# Altium project Carte_GR_2017_logique_v1.PrjPCB (part 2 of 2)

## Sheet interfaces_fpga.SchDoc
size A3
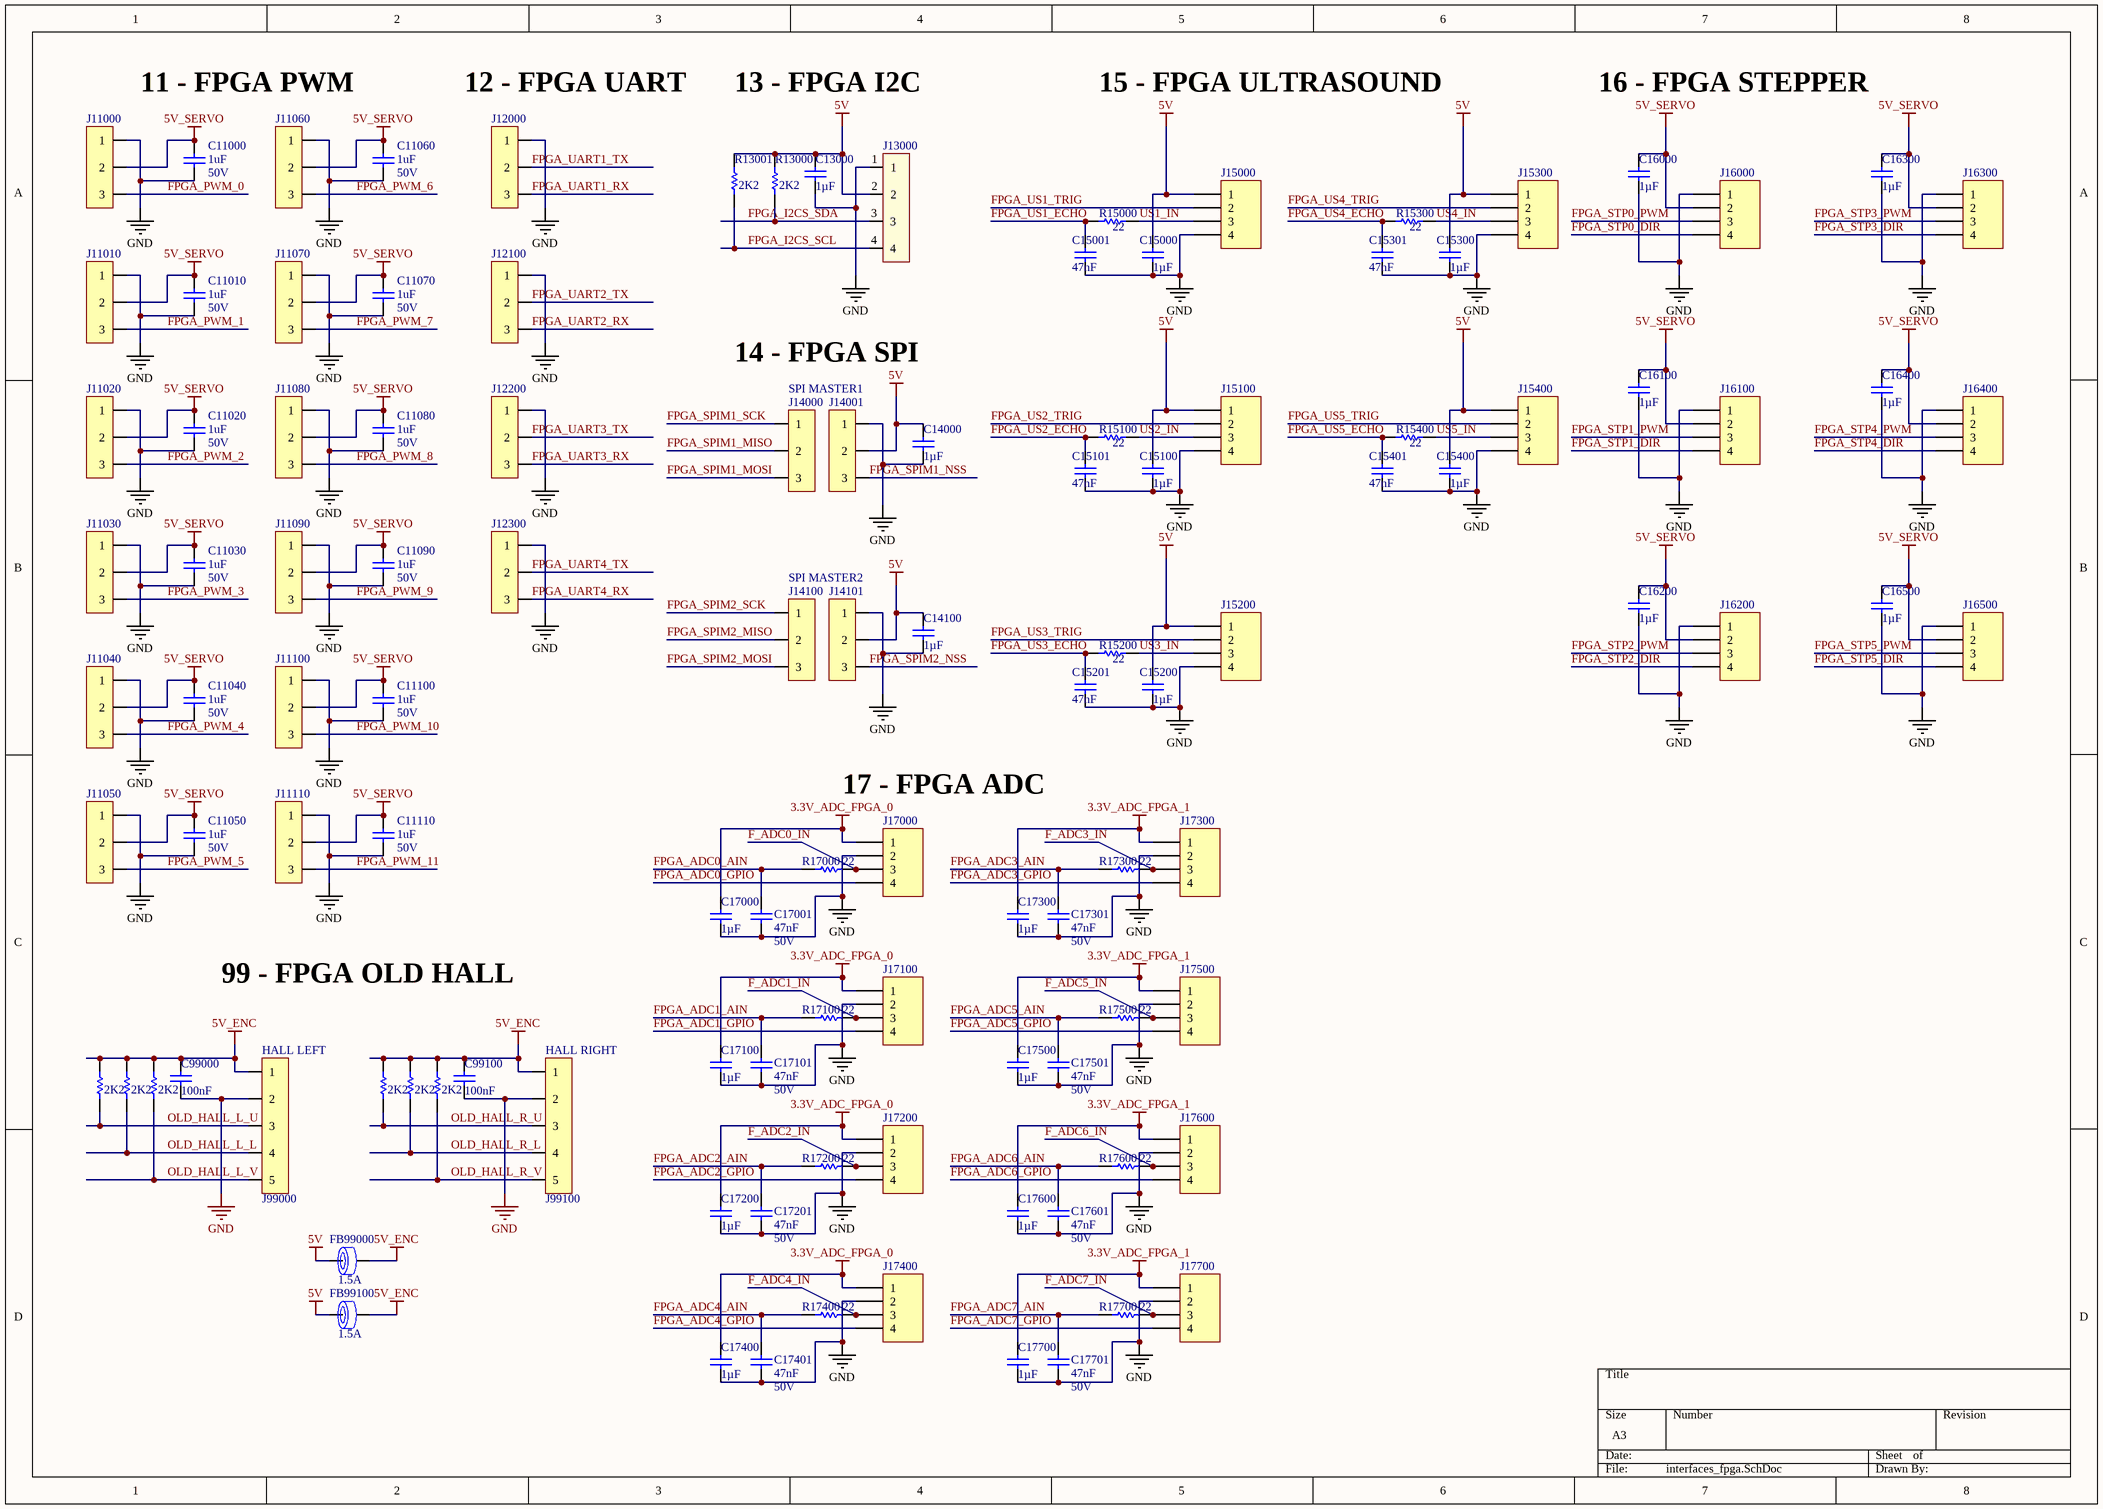
[diagram p2: interfaces_fpga.SchDoc]

### Parts
C11000  1uF  RatedVoltage: 50V  [WCAP-CSGP_0805, 2x1.25x1.25]
C11010  1uF  RatedVoltage: 50V  [WCAP-CSGP_0805, 2x1.25x1.25]
C11020  1uF  RatedVoltage: 50V  [WCAP-CSGP_0805, 2x1.25x1.25]
C11030  1uF  RatedVoltage: 50V  [WCAP-CSGP_0805, 2x1.25x1.25]
C11040  1uF  RatedVoltage: 50V  [WCAP-CSGP_0805, 2x1.25x1.25]
C11050  1uF  RatedVoltage: 50V  [WCAP-CSGP_0805, 2x1.25x1.25]
C11060  1uF  RatedVoltage: 50V  [WCAP-CSGP_0805, 2x1.25x1.25]
C11070  1uF  RatedVoltage: 50V  [WCAP-CSGP_0805, 2x1.25x1.25]
C11080  1uF  RatedVoltage: 50V  [WCAP-CSGP_0805, 2x1.25x1.25]
C11090  1uF  RatedVoltage: 50V  [WCAP-CSGP_0805, 2x1.25x1.25]
C11100  1uF  RatedVoltage: 50V  [WCAP-CSGP_0805, 2x1.25x1.25]
C11110  1uF  RatedVoltage: 50V  [WCAP-CSGP_0805, 2x1.25x1.25]
C13000  1µF  [WCAP-CSGP_0603, 1.6x0.8x0.8]
C14000  1µF  [WCAP-CSGP_0603, 1.6x0.8x0.8]
C14100  1µF  [WCAP-CSGP_0603, 1.6x0.8x0.8]
C15000  1µF  [WCAP-CSGP_0603, 1.6x0.8x0.8]
C15001  47nF  [WCAP-CSGP_0603, 1.6x0.8x0.8]
C15100  1µF  [WCAP-CSGP_0603, 1.6x0.8x0.8]
C15101  47nF  [WCAP-CSGP_0603, 1.6x0.8x0.8]
C15200  1µF  [WCAP-CSGP_0603, 1.6x0.8x0.8]
C15201  47nF  [WCAP-CSGP_0603, 1.6x0.8x0.8]
C15300  1µF  [WCAP-CSGP_0603, 1.6x0.8x0.8]
C15301  47nF  [WCAP-CSGP_0603, 1.6x0.8x0.8]
C15400  1µF  [WCAP-CSGP_0603, 1.6x0.8x0.8]
C15401  47nF  [WCAP-CSGP_0603, 1.6x0.8x0.8]
C16000  1µF  [WCAP-CSGP_0603, 1.6x0.8x0.8]
C16100  1µF  [WCAP-CSGP_0603, 1.6x0.8x0.8]
C16200  1µF  [WCAP-CSGP_0603, 1.6x0.8x0.8]
C16300  1µF  [WCAP-CSGP_0603, 1.6x0.8x0.8]
C16400  1µF  [WCAP-CSGP_0603, 1.6x0.8x0.8]
C16500  1µF  [WCAP-CSGP_0603, 1.6x0.8x0.8]
C17000  1µF  [WCAP-CSGP_0603, 1.6x0.8x0.8]
C17001  47nF  RatedVoltage: 50V  [WCAP-CSGP_0603, 1.6x0.8x0.8]
C17100  1µF  [WCAP-CSGP_0603, 1.6x0.8x0.8]
C17101  47nF  RatedVoltage: 50V  [WCAP-CSGP_0603, 1.6x0.8x0.8]
C17200  1µF  [WCAP-CSGP_0603, 1.6x0.8x0.8]
C17201  47nF  RatedVoltage: 50V  [WCAP-CSGP_0603, 1.6x0.8x0.8]
C17300  1µF  [WCAP-CSGP_0603, 1.6x0.8x0.8]
C17301  47nF  RatedVoltage: 50V  [WCAP-CSGP_0603, 1.6x0.8x0.8]
C17400  1µF  [WCAP-CSGP_0603, 1.6x0.8x0.8]
C17401  47nF  RatedVoltage: 50V  [WCAP-CSGP_0603, 1.6x0.8x0.8]
C17500  1µF  [WCAP-CSGP_0603, 1.6x0.8x0.8]
C17501  47nF  RatedVoltage: 50V  [WCAP-CSGP_0603, 1.6x0.8x0.8]
C17600  1µF  [WCAP-CSGP_0603, 1.6x0.8x0.8]
C17601  47nF  RatedVoltage: 50V  [WCAP-CSGP_0603, 1.6x0.8x0.8]
C17700  1µF  [WCAP-CSGP_0603, 1.6x0.8x0.8]
C17701  47nF  RatedVoltage: 50V  [WCAP-CSGP_0603, 1.6x0.8x0.8]
C99000  100nF  [WCAP-CSGP_0603, 1.6x0.8x0.8]
C99100  100nF  [WCAP-CSGP_0603, 1.6x0.8x0.8]
FB99000  RatedCurrent: 1.5A  [WE-CBF_0603_High Current]  (hidden comment: 742792624)
FB99100  RatedCurrent: 1.5A  [WE-CBF_0603_High Current]  (hidden comment: 742792624)
J11000  22-03-2031  [22-03-2031]  (value not drawn)
J11010  22-03-2031  [22-03-2031]  (value not drawn)
J11020  22-03-2031  [22-03-2031]  (value not drawn)
J11030  22-03-2031  [22-03-2031]  (value not drawn)
J11040  22-03-2031  [22-03-2031]  (value not drawn)
J11050  22-03-2031  [22-03-2031]  (value not drawn)
J11060  22-03-2031  [22-03-2031]  (value not drawn)
J11070  22-03-2031  [22-03-2031]  (value not drawn)
J11080  22-03-2031  [22-03-2031]  (value not drawn)
J11090  22-03-2031  [22-03-2031]  (value not drawn)
J11100  22-03-2031  [22-03-2031]  (value not drawn)
J11110  22-03-2031  [22-03-2031]  (value not drawn)
J12000  22-03-2031  [22-03-2031]  (value not drawn)
J12100  22-03-2031  [22-03-2031]  (value not drawn)
J12200  22-03-2031  [22-03-2031]  (value not drawn)
J12300  22-03-2031  [22-03-2031]  (value not drawn)
J13000  22-27-2041  [22-27-2041]  (value not drawn)
J14000  22-03-2031  [22-03-2031]  (value not drawn)
J14001  22-03-2031  [22-03-2031]  (value not drawn)
J14100  22-03-2031  [22-03-2031]  (value not drawn)
J14101  22-03-2031  [22-03-2031]  (value not drawn)
J15000  MC34645  [HDR1X4]  (value not drawn)
J15100  MC34645  [HDR1X4]  (value not drawn)
J15200  MC34645  [HDR1X4]  (value not drawn)
J15300  MC34645  [HDR1X4]  (value not drawn)
J15400  MC34645  [HDR1X4]  (value not drawn)
J16000  MC34645  [HDR1X4]  (value not drawn)
J16100  MC34645  [HDR1X4]  (value not drawn)
J16200  MC34645  [HDR1X4]  (value not drawn)
J16300  MC34645  [HDR1X4]  (value not drawn)
J16400  MC34645  [HDR1X4]  (value not drawn)
J16500  MC34645  [HDR1X4]  (value not drawn)
J17000  MC34645  [HDR1X4]  (value not drawn)
J17100  MC34645  [HDR1X4]  (value not drawn)
J17200  MC34645  [HDR1X4]  (value not drawn)
J17300  MC34645  [HDR1X4]  (value not drawn)
J17400  MC34645  [HDR1X4]  (value not drawn)
J17500  MC34645  [HDR1X4]  (value not drawn)
J17600  MC34645  [HDR1X4]  (value not drawn)
J17700  MC34645  [HDR1X4]  (value not drawn)
J99000  22-03-2051  [22-03-2051]  (value not drawn)
J99100  22-03-2051  [22-03-2051]  (value not drawn)
R13000  value 2K2  [RESC1005X04N]  (hidden comment: RC0402FR-07100RL)
R13001  value 2K2  [RESC1005X04N]  (hidden comment: RC0402FR-07100RL)
R15000  value 22  [RESC1005X04N]  (hidden comment: RC0402FR-0722RL)
R15100  value 22  [RESC1005X04N]  (hidden comment: RC0402FR-0722RL)
R15200  value 22  [RESC1005X04N]  (hidden comment: RC0402FR-0722RL)
R15300  value 22  [RESC1005X04N]  (hidden comment: RC0402FR-0722RL)
R15400  value 22  [RESC1005X04N]  (hidden comment: RC0402FR-0722RL)
R17000  value 22  [RESC1005X04N]  (hidden comment: RC0402FR-0722RL)
R17100  value 22  [RESC1005X04N]  (hidden comment: RC0402FR-0722RL)
R17200  value 22  [RESC1005X04N]  (hidden comment: RC0402FR-0722RL)
R17300  value 22  [RESC1005X04N]  (hidden comment: RC0402FR-0722RL)
R17400  value 22  [RESC1005X04N]  (hidden comment: RC0402FR-0722RL)
R17500  value 22  [RESC1005X04N]  (hidden comment: RC0402FR-0722RL)
R17600  value 22  [RESC1005X04N]  (hidden comment: RC0402FR-0722RL)
R17700  value 22  [RESC1005X04N]  (hidden comment: RC0402FR-0722RL)
R99000  value 2K2  [RESC1005X04N]  (hidden comment: RC0402FR-07100RL)
R99001  value 2K2  [RESC1005X04N]  (hidden comment: RC0402FR-07100RL)
R99002  value 2K2  [RESC1005X04N]  (hidden comment: RC0402FR-07100RL)
R99100  value 2K2  [RESC1005X04N]  (hidden comment: RC0402FR-07100RL)
R99101  value 2K2  [RESC1005X04N]  (hidden comment: RC0402FR-07100RL)
R99102  value 2K2  [RESC1005X04N]  (hidden comment: RC0402FR-07100RL)

### Nets
3.3V_ADC_FPGA_0: C17000.1 C17100.1 C17200.1 C17400.1 J17000.1 J17100.1 J17200.1 J17400.1
3.3V_ADC_FPGA_1: C17300.1 C17500.1 C17600.1 C17700.1 J17300.1 J17500.1 J17600.1 J17700.1
5V: C13000.1 C14000.1 C14100.1 C15000.1 C15100.1 C15200.1 C15300.1 C15400.1 FB99000.1 FB99100.1 J13000.2 J14001.2 J14101.2 J15000.1 J15100.1 J15200.1 J15300.1 J15400.1 R13000.2 R13001.2
5V_ENC: C99000.1 C99100.1 FB99000.2 FB99100.2 J99000.1 J99100.1 R99000.2 R99001.2 R99002.2 R99100.2 R99101.2 R99102.2
5V_SERVO: C11000.2 C11010.2 C11020.2 C11030.2 C11040.2 C11050.2 C11060.2 C11070.2 C11080.2 C11090.2 C11100.2 C11110.2 C16000.1 C16100.1 C16200.1 C16300.1 C16400.1 C16500.1 J11000.2 J11010.2 J11020.2 J11030.2 J11040.2 J11050.2 J11060.2 J11070.2 J11080.2 J11090.2 J11100.2 J11110.2 J16000.2 J16100.2 J16200.2 J16300.2 J16400.2 J16500.2
GND: C11000.1 C11010.1 C11020.1 C11030.1 C11040.1 C11050.1 C11060.1 C11070.1 C11080.1 C11090.1 C11100.1 C11110.1 C13000.2 C14000.2 C14100.2 C15000.2 C15001.1 C15100.2 C15101.1 C15200.2 C15201.1 C15300.2 C15301.1 C15400.2 C15401.1 C16000.2 C16100.2 C16200.2 C16300.2 C16400.2 C16500.2 C17000.2 C17001.1 C17100.2 C17101.1 C17200.2 C17201.1 C17300.2 C17301.1 C17400.2 C17401.1 C17500.2 C17501.1 C17600.2 C17601.1 C17700.2 C17701.1 C99000.2 C99100.2 J11000.1 J11010.1 J11020.1 J11030.1 J11040.1 J11050.1 J11060.1 J11070.1 J11080.1 J11090.1 J11100.1 J11110.1 J12000.1 J12100.1 J12200.1 J12300.1 J13000.1 J14001.1 J14101.1 J15000.4 J15100.4 J15200.4 J15300.4 J15400.4 J16000.1 J16100.1 J16200.1 J16300.1 J16400.1 J16500.1 J17000.2 J17100.2 J17200.2 J17300.2 J17400.2 J17500.2 J17600.2 J17700.2 J99000.2 J99100.2
F_ADC0_IN: J17000.3 R17000.2
F_ADC1_IN: J17100.3 R17100.2
F_ADC2_IN: J17200.3 R17200.2
F_ADC3_IN: J17300.3 R17300.2
F_ADC4_IN: J17400.3 R17400.2
F_ADC5_IN: J17500.3 R17500.2
F_ADC6_IN: J17600.3 R17600.2
F_ADC7_IN: J17700.3 R17700.2
FPGA_ADC0_AIN: C17001.2 R17000.1
FPGA_ADC0_GPIO: J17000.4
FPGA_ADC1_AIN: C17101.2 R17100.1
FPGA_ADC1_GPIO: J17100.4
FPGA_ADC2_AIN: C17201.2 R17200.1
FPGA_ADC2_GPIO: J17200.4
FPGA_ADC3_AIN: C17301.2 R17300.1
FPGA_ADC3_GPIO: J17300.4
FPGA_ADC4_AIN: C17401.2 R17400.1
FPGA_ADC4_GPIO: J17400.4
FPGA_ADC5_AIN: C17501.2 R17500.1
FPGA_ADC5_GPIO: J17500.4
FPGA_ADC6_AIN: C17601.2 R17600.1
FPGA_ADC6_GPIO: J17600.4
FPGA_ADC7_AIN: C17701.2 R17700.1
FPGA_ADC7_GPIO: J17700.4
FPGA_I2CS_SCL: J13000.4 R13001.1
FPGA_I2CS_SDA: J13000.3 R13000.1
FPGA_PWM_0: J11000.3
FPGA_PWM_1: J11010.3
FPGA_PWM_2: J11020.3
FPGA_PWM_3: J11030.3
FPGA_PWM_4: J11040.3
FPGA_PWM_5: J11050.3
FPGA_PWM_6: J11060.3
FPGA_PWM_7: J11070.3
FPGA_PWM_8: J11080.3
FPGA_PWM_9: J11090.3
FPGA_PWM_10: J11100.3
FPGA_PWM_11: J11110.3
FPGA_SPIM1_MISO: J14000.2
FPGA_SPIM1_MOSI: J14000.3
FPGA_SPIM1_NSS: J14001.3
FPGA_SPIM1_SCK: J14000.1
FPGA_SPIM2_MISO: J14100.2
FPGA_SPIM2_MOSI: J14100.3
FPGA_SPIM2_NSS: J14101.3
FPGA_SPIM2_SCK: J14100.1
FPGA_STP0_DIR: J16000.4
FPGA_STP0_PWM: J16000.3
FPGA_STP1_DIR: J16100.4
FPGA_STP1_PWM: J16100.3
FPGA_STP2_DIR: J16200.4
FPGA_STP2_PWM: J16200.3
FPGA_STP3_DIR: J16300.4
FPGA_STP3_PWM: J16300.3
FPGA_STP4_DIR: J16400.4
FPGA_STP4_PWM: J16400.3
FPGA_STP5_DIR: J16500.4
FPGA_STP5_PWM: J16500.3
FPGA_UART1_RX: J12000.3
FPGA_UART1_TX: J12000.2
FPGA_UART2_RX: J12100.3
FPGA_UART2_TX: J12100.2
FPGA_UART3_RX: J12200.3
FPGA_UART3_TX: J12200.2
FPGA_UART4_RX: J12300.3
FPGA_UART4_TX: J12300.2
FPGA_US1_ECHO: C15001.2 R15000.1
FPGA_US1_TRIG: J15000.2
FPGA_US2_ECHO: C15101.2 R15100.1
FPGA_US2_TRIG: J15100.2
FPGA_US3_ECHO: C15201.2 R15200.1
FPGA_US3_TRIG: J15200.2
FPGA_US4_ECHO: C15301.2 R15300.1
FPGA_US4_TRIG: J15300.2
FPGA_US5_ECHO: C15401.2 R15400.1
FPGA_US5_TRIG: J15400.2
OLD_HALL_L_L: J99000.4 R99001.1
OLD_HALL_L_U: J99000.3 R99000.1
OLD_HALL_L_V: J99000.5 R99002.1
OLD_HALL_R_L: J99100.4 R99101.1
OLD_HALL_R_U: J99100.3 R99100.1
OLD_HALL_R_V: J99100.5 R99102.1
US1_IN: J15000.3 R15000.2
US2_IN: J15100.3 R15100.2
US3_IN: J15200.3 R15200.2
US4_IN: J15300.3 R15300.2
US5_IN: J15400.3 R15400.2

### Notes on the sheet
- 11 - FPGA PWM
- (near J12000) 12 - FPGA UART
- 13 - FPGA I2C
- 15 - FPGA ULTRASOUND
- 16 - FPGA STEPPER
- 14 - FPGA SPI
- SPI MASTER1
- SPI MASTER2
- (near J17000) 17 - FPGA ADC
- 99 - FPGA OLD HALL
- (near J99000) HALL LEFT
- (near J99100) HALL RIGHT

### Library data of the parts
C11000 C11010 C11020 C11030 C11040 C11050 C11060 C11070 C11080 C11090 C11100 C11110 = WCAP-CSGP, 885012207103: CAP CER 1uF 50V X7R 0805; Manufacturer: Wurth Elektronik; PublishedDate: Aug 2016; ComponentLink1Description: Manufacturer; ComponentLink1URL: http://www.we-online.de; ComponentLink2Description: Datasheet; ComponentLink2URL: http://katalog.we-online.com/pbs/datasheet/885012207103.pdf; Manufacturer Part Number: 885012207103; Value: 1uF; Size: 0805; CeramicType: X7R; ComponentClass: 11_FPGA_PWM
C13000 C14000 C14100 C15000 C15100 C15200 C15300 C15400 C16000 C16100 C16200 C16300 C16400 C16500 C17000 C17100 C17200 C17300 C17400 C17500 C17600 C17700 C99000 C99100 = WCAP-CSGP, 885012206095: CAP CER 100nF 50V X7R 0603; Manufacturer: Wurth Elektronik; PublishedDate: Aug 2016; ComponentLink1Description: Manufacturer; ComponentLink1URL: http://www.we-online.de; ComponentLink2Description: Datasheet; ComponentLink2URL: http://katalog.we-online.com/pbs/datasheet/885012206095.pdf; Manufacturer Part Number: 885012206095; Value: 100nF; Size: 0603; CeramicType: X7R; RatedVoltage: 50V
  C13000: ComponentClass: 13_FPGA_I2C
  C14000 C14100: ComponentClass: 14_FPGA_SPI
  C15000 C15100 C15200 C15300 C15400: ComponentClass: 15_FPGA_US
  C16000 C16100 C16200 C16300 C16400 C16500: ComponentClass: 16_FPGA_STP
  C17000 C17100 C17200 C17300 C17400 C17500 C17600 C17700: ComponentClass: 17_FPGA_ADC
  C99000 C99100: ComponentClass: 99_FPGA_HALL
C15001 C15101 C15201 C15301 C15401 C17001 C17101 C17201 C17301 C17401 C17501 C17601 C17701 = WCAP-CSGP, 885012206093: CAP CER 47nF 50V X7R 0603; Manufacturer: Wurth Elektronik; PublishedDate: Aug 2016; ComponentLink1Description: Manufacturer; ComponentLink1URL: http://www.we-online.de; ComponentLink2Description: Datasheet; ComponentLink2URL: http://katalog.we-online.com/pbs/datasheet/885012206093.pdf; Manufacturer Part Number: 885012206093; Value: 47nF; Size: 0603; CeramicType: X7R
  C15001 C15101 C15201 C15301 C15401: RatedVoltage: 50V; ComponentClass: 15_FPGA_US
  C17001 C17101 C17201 C17301 C17401 C17501 C17601 C17701: ComponentClass: 17_FPGA_ADC
FB99000 FB99100 = WE-CBF, 742792624: Ferrite Bead 180ohm 0603 max1.5A; Manufacturer: Wurth Elektronik; Value: 180Ω; Type: High Current; PublishedDate: Aug 2016; ComponentLink1Description: Manufacturer; ComponentLink1URL: http://www.we-online.de; ComponentLink2Description: Datasheet; ComponentLink2URL: http://katalog.we-online.de/pbs/datasheet/742792624.pdf; Manufacturer Part Number: 742792624; Size: 0603; ComponentClass: 9_NUCLEO_ODO
J11000 J11010 J11020 J11030 J11040 J11050 J11060 J11070 J11080 J11090 J11100 J11110 J12000 J12100 J12200 J12300 J14000 J14001 J14100 J14101 = 22-03-2031: Manufacturer 1: MOLEX; Supplier 1: Farnell; Supplier Part Number 1: 9731083; Manufacturer Part Number: 22-03-2031; Pricing: 10=0.27, 100=0.242, 200=0.22, 500=0.208, 1000=0.202, 2500=0.196 (EUR); ComponentLink1URL: http://www.farnell.com/cad/1533907.pdf; ComponentLink1Description: http://www.farnell.com/cad/1533907.pdf; ComponentLink2URL: http://www.farnell.com/datasheets/1785732.pdf; ComponentLink2Description: http://www.farnell.com/datasheets/1785732.pdf
  J11000 J11010 J11020 J11030 J11040 J11050 J11060 J11070 J11080 J11090 J11100 J11110: ComponentClass: 11_FPGA_PWM
  J12000 J12100 J12200 J12300: ComponentClass: 12_FPGA_UART
  J14000 J14001 J14100 J14101: ComponentClass: 14_FPGA_SPI
J13000 = 22-27-2041: Manufacturer 1: MOLEX; Manufacturer Part Number: 22-27-2041..; Supplier 1: Farnell; Supplier Part Number 1: 9731164; Pricing: 10=0.28, 100=0.24, 200=0.22, 500=0.199, 1000=0.175, 2500=0.128, 2500=0.0898, 30000=0.0812 (EUR); ComponentLink1URL: http://www.farnell.com/cad/1595526.pdf; ComponentLink1Description: http://www.farnell.com/cad/1595526.pdf; ComponentLink2URL: http://www.farnell.com/datasheets/1803079.pdf; ComponentLink2Description: http://www.farnell.com/datasheets/1803079.pdf; ComponentClass: 15_FPGA_US
J15000 J15100 J15200 J15300 J15400 J16000 J16100 J16200 J16300 J16400 J16500 J17000 J17100 J17200 J17300 J17400 J17500 J17600 J17700 = MC34645: MULTICOMP - MC34645 - EMB. MALE COUDEE  CON. MALE 2.54MM 4VOIE; Supplier 1: Farnell; Manufacturer: MULTICOMP; Manufacturer Part Number: MC34645; ComponentLink1URL: http://www.farnell.com/datasheets/1751312.pdf; ComponentLink1Description: http://www.farnell.com/datasheets/1751312.pdf; Pricing: 1=0.597, 5=0.531, 25=0.465, 50=0.399, 100=0.334, 250=0.138 (EUR); Supplier Part Number 1: 1675775
  J15000 J15100 J15200 J15300 J15400: ComponentClass: 15_FPGA_US
  J16000 J16100 J16200 J16300 J16400 J16500: ComponentClass: 16_FPGA_STP
  J17000 J17100 J17200 J17300 J17400 J17500 J17600 J17700: ComponentClass: 17_FPGA_ADC
J99000 J99100 = 22-03-2051: Manufacturer 1: MOLEX; Supplier 1: Farnell; Supplier Part Number 1: 9731105; Manufacturer Part Number: 22-03-2051; Pricing: 10=0.43, 100=0.35, 200=0.29, 500=0.26, 1000=0.24, 2500=0.191, 2500=0.172, 20000=0.155 (EUR); ComponentLink1URL: http://www.farnell.com/cad/1533907.pdf; ComponentLink1Description: http://www.farnell.com/cad/1533907.pdf; ComponentLink2URL: http://www.farnell.com/datasheets/1803075.pdf; ComponentLink2Description: http://www.farnell.com/datasheets/1803075.pdf; ComponentClass: 99_FPGA_HALL
R13000 R13001 R99000-R99002 R99100-R99102 = RC0402FR-07100RL: RES SMD 100 OHM 1% 1/16W 0402; Manufacturer: Yageo; Power: 63mW; Vmax: 50V; Type: Thick Film; ComponentLink1Description: Manufacturer; ComponentLink1URL: http://www.yageo.com/NewPortal/_en/index.jsp; ComponentLink2Description: Datasheet; ComponentLink2URL: http://www.farnell.com/datasheets/2167052.pdf; Manufacturer Part Number: RC0402FR-07100RL; Supplier 1: Farnell; Supplier Part Number 1: 9239111; Precision: ±1%
  R13000 R13001: ComponentClass: 13_FPGA_I2C
  R99000-R99002 R99100-R99102: ComponentClass: 99_FPGA_HALL
R15000 R15100 R15200 R15300 R15400 R17000 R17100 R17200 R17300 R17400 R17500 R17600 R17700 = RC0402FR-0722RL: RES SMD 22 OHM 1% 1/16W 0402; Manufacturer: Yageo; Power: 63mW; Vmax: 50V; Type: Thick Film; ComponentLink1Description: Manufacturer; ComponentLink1URL: http://www.yageo.com/NewPortal/_en/index.jsp; ComponentLink2Description: Datasheet; ComponentLink2URL: http://www.farnell.com/datasheets/2167052.pdf; Manufacturer Part Number: RC0402FR-0722RL; Supplier 1: Farnell; Supplier Part Number 1: 9239030; Precision: ±1%
  R15000 R15100 R15200 R15300 R15400: ComponentClass: 15_FPGA_US
  R17000 R17100 R17200 R17300 R17400 R17500 R17600 R17700: ComponentClass: 17_FPGA_ADC

## Sheet divers.SchDoc
size A3
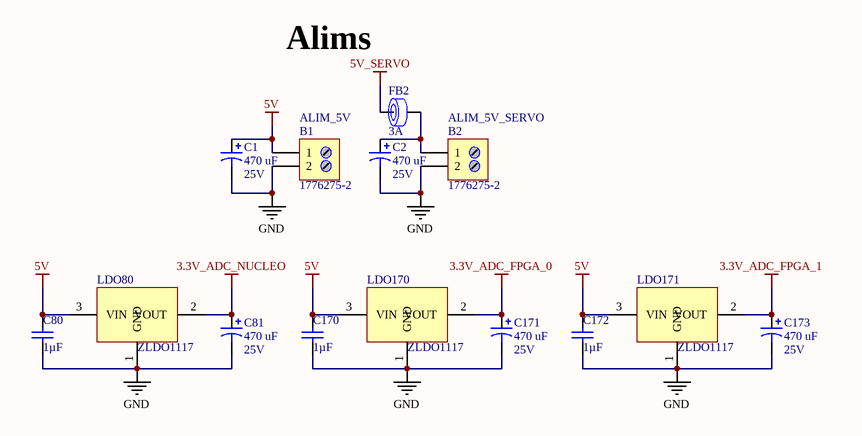
[diagram p3: divers.SchDoc]

### Parts
B1  1776275-2  [BORNIER_2V_3.5MM]
B2  1776275-2  [BORNIER_2V_3.5MM]
C1  470 uF  RatedVoltage: 25V  [WCAP-ATG8_8x11.5x3.5x0.5]
C2  470 uF  RatedVoltage: 25V  [WCAP-ATG8_8x11.5x3.5x0.5]
C80  1µF  [WCAP-CSGP_0603, 1.6x0.8x0.8]
C81  470 uF  RatedVoltage: 25V  [WCAP-ATG8_8x11.5x3.5x0.5]
C170  1µF  [WCAP-CSGP_0603, 1.6x0.8x0.8]
C171  470 uF  RatedVoltage: 25V  [WCAP-ATG8_8x11.5x3.5x0.5]
C172  1µF  [WCAP-CSGP_0603, 1.6x0.8x0.8]
C173  470 uF  RatedVoltage: 25V  [WCAP-ATG8_8x11.5x3.5x0.5]
FB2  RatedCurrent: 3A  [WE-CBF_0805_High Current]  (hidden comment: 742792023)
LDO80  ZLDO1117  [SOT223_M]
LDO170  ZLDO1117  [SOT223_M]
LDO171  ZLDO1117  [SOT223_M]

### Nets
3.3V_ADC_FPGA_0: C171.1 LDO170.2(VOUT)
3.3V_ADC_FPGA_1: C173.1 LDO171.2(VOUT)
3.3V_ADC_NUCLEO: C81.1 LDO80.2(VOUT)
5V: B1.1 C1.1 C80.1 C170.1 C172.1 LDO80.3(VIN) LDO170.3(VIN) LDO171.3(VIN)
5V_SERVO: FB2.1
GND: B1.2 B2.2 C1.2 C2.2 C80.2 C81.2 C170.2 C171.2 C172.2 C173.2 LDO80.1(GND) LDO170.1(GND) LDO171.1(GND)
NetB2_1: B2.1 C2.1 FB2.2

### Notes on the sheet
- Alims
- (near B1) ALIM_5V
- ALIM_5V_SERVO

### Library data of the parts
B1 B2 = 1776275-2: TERM BLOCK 2POS SIDE ENT 3.5MM; Manufacturer: TE Connectivity AMP Connectors; Supplier 1: Farnell; Supplier Part Number 1: 1098611; Manufacturer Part Number: 1776275-2; ComponentLink1URL: http://www.te.com/commerce/DocumentDelivery/DDEController?Action=srchrtrv&DocNm=1776275&DocType=Customer+Drawing&DocLang=English; ComponentLink1Description: http://www.te.com/commerce/DocumentDelivery/DDEController?Action=srchrtrv&DocNm=1776275&DocType=Customer+Drawing&DocLang=English
C1 C2 C81 C171 C173 = WCAP-ATG8, 860010474013: CAP Alu 470 UF 20% 25 V; Manufacturer: Wurth Elektronik; PublishedDate: July 2016; ComponentLink1Description: Manufacturer; ComponentLink1URL: http://www.we-online.de; ComponentLink2Description: Datasheet; ComponentLink2URL: http://katalog.we-online.de/pbs/datasheet/860010474013.pdf; Manufacturer Part Number: 860010474013; Value: 470 uF; Size: 8mmx11.5mm
C80 C170 C172 = WCAP-CSGP, 885012206095: as C13000 on sheet interfaces_fpga; PublishedDate: Aug 2016; ComponentLink1Description: Manufacturer; ComponentLink1URL: http://www.we-online.de; ComponentLink2Description: Datasheet; ComponentLink2URL: http://katalog.we-online.com/pbs/datasheet/885012206095.pdf; Manufacturer Part Number: 885012206095; Value: 100nF; Size: 0603; CeramicType: X7R; RatedVoltage: 50V; ComponentClass: 15_FPGA_US
FB2 = WE-CBF, 742792023: Ferrite Bead 120ohm 0805 max3.0A; Manufacturer: Wurth Elektronik; Value: 120Ω; Type: High Current; PublishedDate: Aug 2016; ComponentLink1Description: Manufacturer; ComponentLink1URL: http://www.we-online.de; ComponentLink2Description: Datasheet; ComponentLink2URL: http://katalog.we-online.de/pbs/datasheet/742792023.pdf; Manufacturer Part Number: 742792023; Size: 0805
LDO80 LDO170 LDO171 = ZLDO1117: Manufacturer: Diodes Incorporated; Manufacturer Part Number: ZLDO1117; Supplier 1: fr.farnell; Supplier Part Number 1: 1825376

## Nets that join several sheets
3.3V_ADC_FPGA_0: interfaces_fpga (8 pins), divers (C171.1 LDO170.2)
3.3V_ADC_FPGA_1: interfaces_fpga (8 pins), divers (C173.1 LDO171.2)
3.3V_ADC_NUCLEO: interfaces_nucleo (C8000.1 C8100.1 J8000.1 J8100.1), divers (C81.1 LDO80.2)
5V: core_logique (C3.2 XM1.1), interfaces_nucleo (28 pins), interfaces_fpga (20 pins), divers (8 pins)
5V_ENC: interfaces_nucleo (8 pins), interfaces_fpga (12 pins)
5V_SERVO: interfaces_nucleo (10 pins), interfaces_fpga (36 pins), divers (FB2.1)
GND: core_logique (14 pins), interfaces_nucleo (73 pins), interfaces_fpga (89 pins), divers (13 pins)
FPGA_ADC0_AIN: core_logique (R147.2), interfaces_fpga (C17001.2 R17000.1)
FPGA_ADC0_GPIO: core_logique (R130.1), interfaces_fpga (J17000.4)
FPGA_ADC1_AIN: core_logique (R135.1), interfaces_fpga (C17101.2 R17100.1)
FPGA_ADC1_GPIO: core_logique (R131.1), interfaces_fpga (J17100.4)
FPGA_ADC2_AIN: core_logique (R146.2), interfaces_fpga (C17201.2 R17200.1)
FPGA_ADC2_GPIO: core_logique (R129.1), interfaces_fpga (J17200.4)
FPGA_ADC3_AIN: core_logique (R133.1), interfaces_fpga (C17301.2 R17300.1)
FPGA_ADC3_GPIO: core_logique (R142.2), interfaces_fpga (J17300.4)
FPGA_ADC4_AIN: core_logique (R134.1), interfaces_fpga (C17401.2 R17400.1)
FPGA_ADC4_GPIO: core_logique (R143.2), interfaces_fpga (J17400.4)
FPGA_ADC5_AIN: core_logique (R144.2), interfaces_fpga (C17501.2 R17500.1)
FPGA_ADC5_GPIO: core_logique (R140.2), interfaces_fpga (J17500.4)
FPGA_ADC6_AIN: core_logique (R132.1), interfaces_fpga (C17601.2 R17600.1)
FPGA_ADC6_GPIO: core_logique (R128.1), interfaces_fpga (J17600.4)
FPGA_ADC7_AIN: core_logique (R145.2), interfaces_fpga (C17701.2 R17700.1)
FPGA_ADC7_GPIO: core_logique (R141.2), interfaces_fpga (J17700.4)
FPGA_I2CS_SCL: core_logique (R106.1), interfaces_fpga (J13000.4 R13001.1)
FPGA_I2CS_SDA: core_logique (R121.2), interfaces_fpga (J13000.3 R13000.1)
FPGA_PWM_0: core_logique (R122.2), interfaces_fpga (J11000.3)
FPGA_PWM_1: core_logique (R107.1), interfaces_fpga (J11010.3)
FPGA_PWM_2: core_logique (R123.2), interfaces_fpga (J11020.3)
FPGA_PWM_3: core_logique (R108.1), interfaces_fpga (J11030.3)
FPGA_PWM_4: core_logique (R138.2), interfaces_fpga (J11040.3)
FPGA_PWM_5: core_logique (R126.1), interfaces_fpga (J11050.3)
FPGA_PWM_6: core_logique (R139.2), interfaces_fpga (J11060.3)
FPGA_PWM_7: core_logique (R127.1), interfaces_fpga (J11070.3)
FPGA_PWM_8: core_logique (R86.2), interfaces_fpga (J11080.3)
FPGA_PWM_9: core_logique (R87.2), interfaces_fpga (J11090.3)
FPGA_PWM_10: core_logique (R74.1), interfaces_fpga (J11100.3)
FPGA_PWM_11: core_logique (R88.2), interfaces_fpga (J11110.3)
FPGA_SPIM1_MISO: core_logique (R91.2), interfaces_fpga (J14000.2)
FPGA_SPIM1_MOSI: core_logique (R79.1), interfaces_fpga (J14000.3)
FPGA_SPIM1_NSS: core_logique (R92.2), interfaces_fpga (J14001.3)
FPGA_SPIM1_SCK: core_logique (R78.1), interfaces_fpga (J14000.1)
FPGA_SPIM2_MISO: core_logique (R76.1), interfaces_fpga (J14100.2)
FPGA_SPIM2_MOSI: core_logique (R77.1), interfaces_fpga (J14100.3)
FPGA_SPIM2_NSS: core_logique (R90.2), interfaces_fpga (J14101.3)
FPGA_SPIM2_SCK: core_logique (R89.2), interfaces_fpga (J14100.1)
FPGA_STP0_DIR: core_logique (R116.2), interfaces_fpga (J16000.4)
FPGA_STP0_PWM: core_logique (R115.2), interfaces_fpga (J16000.3)
FPGA_STP1_DIR: core_logique (R101.1), interfaces_fpga (J16100.4)
FPGA_STP1_PWM: core_logique (R100.1), interfaces_fpga (J16100.3)
FPGA_STP2_DIR: core_logique (R114.2), interfaces_fpga (J16200.4)
FPGA_STP2_PWM: core_logique (R99.1), interfaces_fpga (J16200.3)
FPGA_STP3_DIR: core_logique (R113.2), interfaces_fpga (J16300.4)
FPGA_STP3_PWM: core_logique (R98.1), interfaces_fpga (J16300.3)
FPGA_STP4_DIR: core_logique (R97.1), interfaces_fpga (J16400.4)
FPGA_STP4_PWM: core_logique (R96.1), interfaces_fpga (J16400.3)
FPGA_STP5_DIR: core_logique (R110.2), interfaces_fpga (J16500.4)
FPGA_STP5_PWM: core_logique (R109.2), interfaces_fpga (J16500.3)
FPGA_UART1_RX: core_logique (R102.1), interfaces_fpga (J12000.3)
FPGA_UART1_TX: core_logique (R117.2), interfaces_fpga (J12000.2)
FPGA_UART2_RX: core_logique (R103.1), interfaces_fpga (J12100.3)
FPGA_UART2_TX: core_logique (R118.2), interfaces_fpga (J12100.2)
FPGA_UART3_RX: core_logique (R104.1), interfaces_fpga (J12200.3)
FPGA_UART3_TX: core_logique (R119.2), interfaces_fpga (J12200.2)
FPGA_UART4_RX: core_logique (R105.1), interfaces_fpga (J12300.3)
FPGA_UART4_TX: core_logique (R120.2), interfaces_fpga (J12300.2)
FPGA_US1_ECHO: core_logique (R85.2), interfaces_fpga (C15001.2 R15000.1)
FPGA_US1_TRIG: core_logique (R83.2), interfaces_fpga (J15000.2)
FPGA_US2_ECHO: core_logique (R125.1), interfaces_fpga (C15101.2 R15100.1)
FPGA_US2_TRIG: core_logique (R137.2), interfaces_fpga (J15100.2)
FPGA_US3_ECHO: core_logique (R124.1), interfaces_fpga (C15201.2 R15200.1)
FPGA_US3_TRIG: core_logique (R136.2), interfaces_fpga (J15200.2)
FPGA_US4_ECHO: core_logique (R94.2), interfaces_fpga (C15301.2 R15300.1)
FPGA_US4_TRIG: core_logique (R81.1), interfaces_fpga (J15300.2)
FPGA_US5_ECHO: core_logique (R93.2), interfaces_fpga (C15401.2 R15400.1)
FPGA_US5_TRIG: core_logique (R80.1), interfaces_fpga (J15400.2)
MAXON1_DIR: core_logique (R65.2), interfaces_nucleo (J10000.6)
MAXON1_PWM: core_logique (R64.1), interfaces_nucleo (J10000.5)
MAXON2_DIR: core_logique (R57.1), interfaces_nucleo (J10000.2)
MAXON2_PWM: core_logique (R58.1), interfaces_nucleo (J10000.3)
MAXON_EN: core_logique (R56.2), interfaces_nucleo (J10000.1)
NUCLEO_ADC1.8_AIN: core_logique (R12.2), interfaces_nucleo (C8101.2 R8100.1)
NUCLEO_ADC1.8_GPIO: core_logique (R22.1), interfaces_nucleo (J8100.4)
NUCLEO_ADC1.9_AIN: core_logique (R13.2), interfaces_nucleo (C8001.2 R8000.1)
NUCLEO_ADC1.9_GPIO: core_logique (R23.1), interfaces_nucleo (J8000.4)
NUCLEO_CAN_RX: core_logique (R43.1), interfaces_nucleo (U5000.4)
NUCLEO_CAN_TX: core_logique (R42.1), interfaces_nucleo (U5000.1)
NUCLEO_DYNA_DIR: core_logique (R41.1), interfaces_nucleo (U4000.4 U4000.5)
NUCLEO_DYNA_RX: core_logique (R38.2), interfaces_nucleo (U4000.3)
NUCLEO_DYNA_TX: core_logique (R51.1), interfaces_nucleo (U4000.6)
NUCLEO_GPIO_PB0: core_logique (R21.1), interfaces_nucleo (J1000.3)
NUCLEO_GPIO_PC6: core_logique (R40.1), interfaces_nucleo (J1600.3)
NUCLEO_GPIO_PC8: core_logique (R39.1), interfaces_nucleo (J1500.3)
NUCLEO_GPIO_PC9: core_logique (R24.2), interfaces_nucleo (J1400.3)
NUCLEO_GPIO_PC13: core_logique (R7.1), interfaces_nucleo (J1300.3)
NUCLEO_GPIO_PC14: core_logique (R8.1), interfaces_nucleo (J1200.3)
NUCLEO_I2C1_SCL: core_logique (R25.2), interfaces_nucleo (J6100.4 R6101.1)
NUCLEO_I2C1_SDA: core_logique (R26.2), interfaces_nucleo (J6100.3 R6100.1)
NUCLEO_I2C2_SCL: core_logique (R11.2), interfaces_nucleo (J6000.4 R6001.1)
NUCLEO_I2C2_SDA: core_logique (R10.1), interfaces_nucleo (J6000.3 R6000.1)
NUCLEO_PWM_T3.2: core_logique (R59.1), interfaces_nucleo (J2000.3)
NUCLEO_PWM_T3.4: core_logique (R47.1), interfaces_nucleo (J2400.3)
NUCLEO_PWM_T4.1: core_logique (R30.2), interfaces_nucleo (J2300.3)
NUCLEO_PWM_T4.2: core_logique (R6.1), interfaces_nucleo (J2100.3)
NUCLEO_PWM_T4.3: core_logique (R3.1), interfaces_nucleo (J2200.3)
NUCLEO_SPI2_MISO: core_logique (R68.2), interfaces_nucleo (J7100.2)
NUCLEO_SPI2_MOSI: core_logique (R69.2), interfaces_nucleo (J7100.3)
NUCLEO_SPI2_NSS: core_logique (R70.2), interfaces_nucleo (J7101.3)
NUCLEO_SPI2_SCK: core_logique (R67.2), interfaces_nucleo (J7100.1)
NUCLEO_SPI3_MISO: core_logique (R62.2), interfaces_nucleo (J7000.2)
NUCLEO_SPI3_MOSI: core_logique (R63.2), interfaces_nucleo (J7000.3)
NUCLEO_SPI3_NSS: core_logique (R82.2), interfaces_nucleo (J7001.3)
NUCLEO_SPI3_SCK: core_logique (R61.2), interfaces_nucleo (J7000.1)
NUCLEO_UART3_RX: core_logique (R66.2), interfaces_nucleo (J3200.3)
NUCLEO_UART3_TX: core_logique (R60.2), interfaces_nucleo (J3200.2)
NUCLEO_UART4_RX: core_logique (R14.1), interfaces_nucleo (J3100.3)
NUCLEO_UART4_TX: core_logique (R52.2), interfaces_nucleo (J3100.2)
NUCLEO_UART5_RX: core_logique (R15.1), interfaces_nucleo (J3000.3)
NUCLEO_UART5_TX: core_logique (R53.2), interfaces_nucleo (J3000.2)
OLD_HALL_L_L: core_logique (R111.2), interfaces_fpga (J99000.4 R99001.1)
OLD_HALL_L_U: core_logique (R112.2), interfaces_fpga (J99000.3 R99000.1)
OLD_HALL_L_V: core_logique (R95.1), interfaces_fpga (J99000.5 R99002.1)
OLD_HALL_R_L: core_logique (R84.2), interfaces_fpga (J99100.4 R99101.1)
OLD_HALL_R_U: core_logique (R75.1), interfaces_fpga (J99100.3 R99100.1)
OLD_HALL_R_V: core_logique (R73.1), interfaces_fpga (J99100.5 R99102.1)
QEI1_CH_A: core_logique (R71.2), interfaces_nucleo (J9000.4 J9001.3)
QEI1_CH_B: core_logique (R72.2), interfaces_nucleo (J9000.6 J9001.5)
QEI2_CH_A: core_logique (R54.2), interfaces_nucleo (J9100.4 J9101.5)
QEI2_CH_B: core_logique (R55.2), interfaces_nucleo (J9100.6 J9101.3)